# EAGLE schematic prospective_detector (EAGLE 9.0.0)
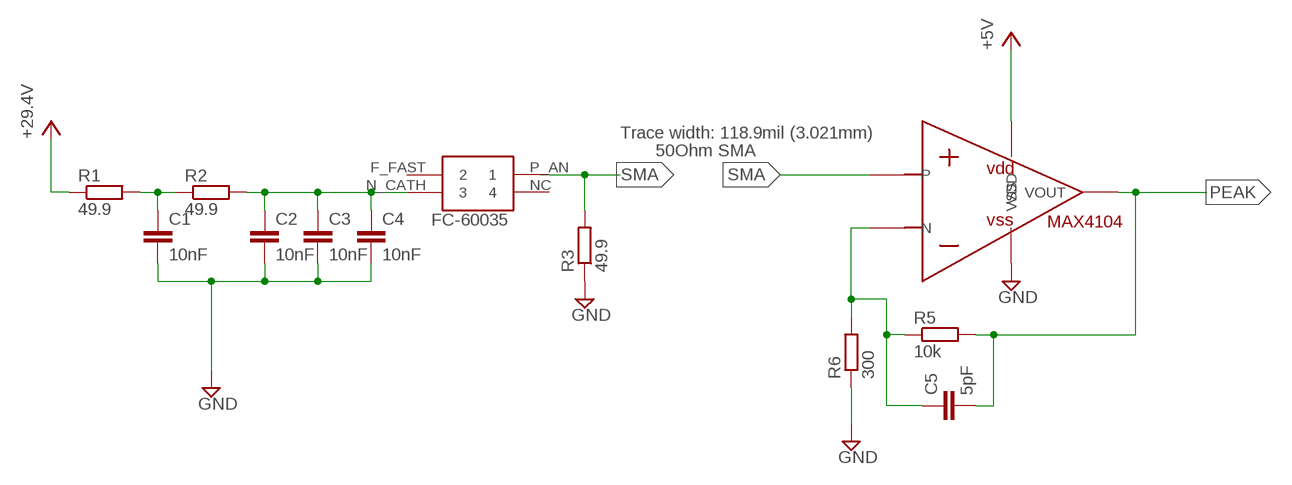
[diagram p0: schematic, sheet 1]

## Parts
C1  10nF  C-EU025-024X044  [C025-024X044]
C2  10nF  C-EU025-024X044  [C025-024X044]
C3  10nF  C-EU025-024X044  [C025-024X044]
C4  10nF  C-EU025-024X044  [C025-024X044]
C5  5pF  C-EU025-024X044  [C025-024X044]
FC-60035  FC-600XXSMT_REFLOW  [FC-600XX-SMT]
MAX4104  OPAMP  (no package)
R1  49.9  R-EU_0204/2V  [0204V]
R2  49.9  R-EU_0204/2V  [0204V]
R3  49.9  R-EU_0204/2V  [0204V]
R5  10k  R-EU_0204/2V  [0204V]
R6  300  R-EU_0204/2V  [0204V]

## Nets
GND: C1.2 C2.2 C3.2 C4.2 MAX4104.VSS R3.1 R6.1
N$1: C1.1 R1.2 R2.1
N$2: C2.1 C3.1 C4.1 FC-60035.N_CATH R2.2
N$9: C5.1 MAX4104.N R5.1 R6.2
PEAK: C5.2 MAX4104.VOUT R5.2
SMA: FC-60035.P_AN MAX4104.P R3.2
VCC: MAX4104.VDD R1.1 ; supply symbol labelled +29.4V, +5V
Unconnected: FC-60035.F_FAST FC-60035.NC

## Notes on the sheet
- Trace width: 118.9mil (3.021mm)
- 50Ohm SMA

## Library data of the parts
C1-C5 = rcl:C-EU: CAPACITOR, European symbol; SPICEPREFIX: C
FC-60035 = 000phys605parts:FC-600XX
MAX4104 = ngspice-simulation:OPAMP: Operational amplifier with power pins
R1-R3 R5 R6 = rcl:R-EU_: RESISTOR, European symbol; SPICEPREFIX: R